# EAGLE design GSIOC (EAGLE 7.1.0)
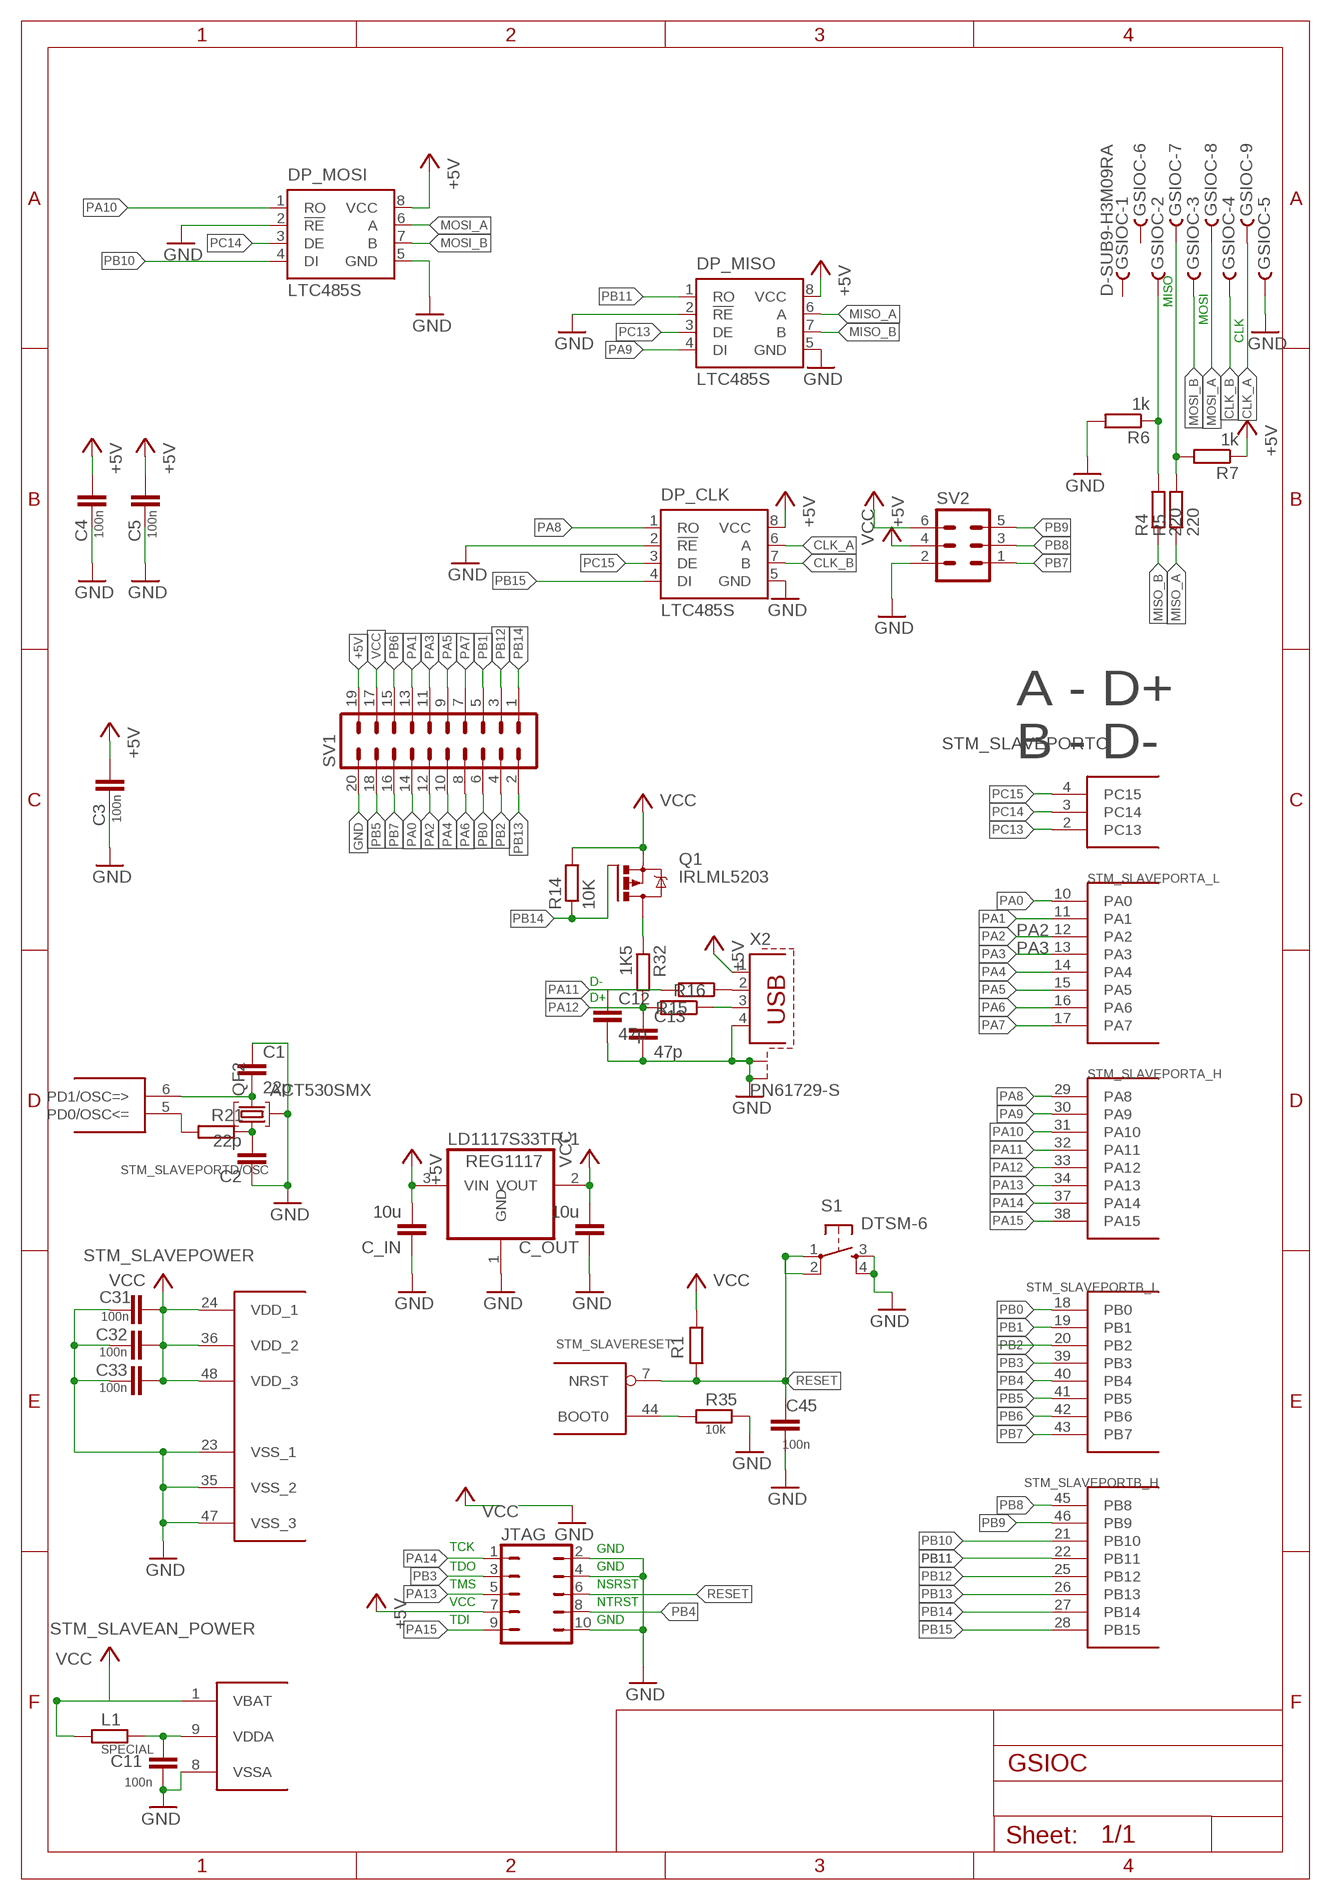
[diagram p0: schematic, sheet 1]

## Parts
C1  22p  C-EUC0805  [C0805]
C2  22p  C-EUC0805  [C0805]
C3  100n  C-EUC0805  [C0805]
C4  100n  C-EUC0805K  [C0805K]
C5  100n  C-EUC0805K  [C0805K]
C11  100n  C-EUC0805  [C0805]
C12  47p  C-EUC0805K  [C0805K]
C13  47p  C-EUC0805K  [C0805K]
C31  100n  C-EUC0805  [C0805]
C32  100n  C-EUC0805  [C0805]
C33  100n  C-EUC0805  [C0805]
C45  100n  C-EUC0805K  [C0805K]
C_IN  10u  C-EUC0805K  [C0805K]
C_OUT  10u  C-EUC0805K  [C0805K]
DP_CLK  LTC485S  [SOIC8]
DP_MISO  LTC485S  [SOIC8]
DP_MOSI  LTC485S  [SOIC8]
GSIOC  D-SUB9-H3M09RA  [H3M09RA]
JTAG  JP5Q  [JP5Q]
L1  SPECIAL  R-EU_M0805  [M0805]
LD1117S33TR-1  REG1117  [SOT223]
Q1  IRLML5203  [MICRO3]
QF2  ACT530SMX  [ACT_530SMX]
R1  5k  R-EU_M0805  [M0805]
R4  220  R-EU_M0805  [M0805]
R5  220  R-EU_M0805  [M0805]
R6  1k  R-EU_M0805  [M0805]
R7  1k  R-EU_M0805  [M0805]
R14  10K  R-EU_M0805  [M0805]
R15  22  R-EU_M0805  [M0805]
R16  22  R-EU_M0805  [M0805]
R21  R-EU_M0805  [M0805]
R32  1K5  R-EU_M0805  [M0805]
R35  10k  R-EU_M0805  [M0805]
S1  DTSM-6  [DTSM-6]
STM_SLAVE  STM32F10XCXT6  [TQFP48]
SV1  ML20L  [ML20L]
SV2  ML6L  [ML6L]
X2  PN61729-S  [PN61729-S]

## Nets
+5V: C3.1 C4.1 C5.1 C_IN.2 DP_CLK.8(VCC) DP_MISO.8(VCC) DP_MOSI.8(VCC) JTAG.7 LD1117S33TR-1.3(VIN) R7.1 SV1.19 SV2.6 X2.1
CLK_A: DP_CLK.6(A) GSIOC.9
CLK_B: DP_CLK.7(B) GSIOC.4
GND: C1.1 C2.1 C3.2 C4.2 C5.2 C11.2 C12.2 C13.2 C31.2 C32.2 C33.2 C45.2 C_IN.1 C_OUT.1 DP_CLK.2(!RE) DP_CLK.5(GND) DP_MISO.2(!RE) DP_MISO.5(GND) DP_MOSI.2(!RE) DP_MOSI.5(GND) GSIOC.5 JTAG.2 JTAG.4 JTAG.10 LD1117S33TR-1.1(GND) QF2.S$1(SHLD) QF2.S$2(SHLD) R6.2 R35.2 S1.3 S1.4 STM_SLAVE.8(AN_POWER:VSSA) STM_SLAVE.23(POWER:VSS_1) STM_SLAVE.35(POWER:VSS_2) STM_SLAVE.47(POWER:VSS_3) SV1.20 SV2.2 X2.4 X2.S1 X2.S2
MISO_A: DP_MISO.6(A) R5.1
MISO_B: DP_MISO.7(B) R4.1
MOSI_A: DP_MOSI.6(A) GSIOC.8
MOSI_B: DP_MOSI.7(B) GSIOC.3
N$1: C11.1 L1.2 STM_SLAVE.9(AN_POWER:VDDA)
N$3: GSIOC.2 R4.2 R6.1
N$5: GSIOC.7 R5.2 R7.2
N$14: R35.1 STM_SLAVE.44(RESET:BOOT0)
N$17: R16.1 X2.2
N$19: Q1.3(D) R32.1
N$21: R15.1 X2.3
N$35: C2.2 QF2.P1 R21.1
OSC<=: R21.2 STM_SLAVE.5(PORTD/OSC:PD0/OSC<=)
OSC=>: C1.2 QF2.P2 STM_SLAVE.6(PORTD/OSC:PD1/OSC=>)
PA0: STM_SLAVE.10(PORTA_L:PA0) SV1.14
PA1: STM_SLAVE.11(PORTA_L:PA1) SV1.13
PA2: STM_SLAVE.12(PORTA_L:PA2) SV1.12
PA3: STM_SLAVE.13(PORTA_L:PA3) SV1.11
PA4: STM_SLAVE.14(PORTA_L:PA4) SV1.10
PA5: STM_SLAVE.15(PORTA_L:PA5) SV1.9
PA6: STM_SLAVE.16(PORTA_L:PA6) SV1.8
PA7: STM_SLAVE.17(PORTA_L:PA7) SV1.7
PA8: DP_CLK.1(RO) STM_SLAVE.29(PORTA_H:PA8)
PA9: DP_MISO.4(DI) STM_SLAVE.30(PORTA_H:PA9)
PA10: DP_MOSI.1(RO) STM_SLAVE.31(PORTA_H:PA10)
PA11: C12.1 R16.2 STM_SLAVE.32(PORTA_H:PA11)
PA12: C13.1 R15.2 R32.2 STM_SLAVE.33(PORTA_H:PA12)
PA13: JTAG.5 STM_SLAVE.34(PORTA_H:PA13)
PA14: JTAG.1 STM_SLAVE.37(PORTA_H:PA14)
PA15: JTAG.9 STM_SLAVE.38(PORTA_H:PA15)
PB0: STM_SLAVE.18(PORTB_L:PB0) SV1.6
PB1: STM_SLAVE.19(PORTB_L:PB1) SV1.5
PB2: STM_SLAVE.20(PORTB_L:PB2) SV1.4
PB3: JTAG.3 STM_SLAVE.39(PORTB_L:PB3)
PB4: JTAG.8 STM_SLAVE.40(PORTB_L:PB4)
PB5: STM_SLAVE.41(PORTB_L:PB5) SV1.18
PB6: STM_SLAVE.42(PORTB_L:PB6) SV1.15
PB7: STM_SLAVE.43(PORTB_L:PB7) SV1.16 SV2.1
PB8: STM_SLAVE.45(PORTB_H:PB8) SV2.3
PB9: STM_SLAVE.46(PORTB_H:PB9) SV2.5
PB10: DP_MOSI.4(DI) STM_SLAVE.21(PORTB_H:PB10)
PB11: DP_MISO.1(RO) STM_SLAVE.22(PORTB_H:PB11)
PB12: STM_SLAVE.25(PORTB_H:PB12) SV1.3
PB13: STM_SLAVE.26(PORTB_H:PB13) SV1.2
PB14: Q1.1(G) R14.1 STM_SLAVE.27(PORTB_H:PB14) SV1.1
PB15: DP_CLK.4(DI) STM_SLAVE.28(PORTB_H:PB15)
PC13: DP_MISO.3(DE) STM_SLAVE.2(PORTC:PC13)
PC14: DP_MOSI.3(DE) STM_SLAVE.3(PORTC:PC14)
PC15: DP_CLK.3(DE) STM_SLAVE.4(PORTC:PC15)
RESET: C45.1 JTAG.6 R1.2 S1.1 S1.2 STM_SLAVE.7(RESET:NRST)
VCC: C31.1 C32.1 C33.1 C_OUT.2 L1.1 LD1117S33TR-1.2(VOUT) Q1.2(S) R1.1 R14.2 STM_SLAVE.1(AN_POWER:VBAT) STM_SLAVE.24(POWER:VDD_1) STM_SLAVE.36(POWER:VDD_2) STM_SLAVE.48(POWER:VDD_3) SV1.17 SV2.4
Unconnected: GSIOC.1 GSIOC.6

## Notes on the sheet
- MISO
- MOSI
- CLK
- A - D+
  B - D-
- D-
- D+
- TCK | GND
- TDO | GND
- TMS | NSRST
- VCC | NTRST
- TDI | GND

## Library data of the parts
C1-C3 C11 C31-C33 = resistor:C-EU: CAPACITOR, European symbol; SPICEPREFIX: C
C4 C5 C12 C13 C45 C_IN C_OUT = rcl:C-EU: CAPACITOR, European symbol
DP_CLK DP_MISO DP_MOSI = linear-technology:LTC485: Low Power RS485 Interface Transceiver Source: http://www.linear.com/pc/downloadDocument.do?navId=H0,C1,C1007,C1017,P2064,D1718; OC_FARNELL: unknown; OC_NEWARK: unknown
GSIOC = con-thomas-betts:D-SUB9-: D-Subminiatur Connector Source: Electronioc Interconnects European Edition 1998; OC_FARNELL: unknown; OC_NEWARK: unknown
JTAG = jumper:JP5Q: JUMPER
L1 R1 R4-R7 R14-R16 R21 R32 R35 = resistor:R-EU_: RESISTOR, European symbol; SPICEPREFIX: R
LD1117S33TR-1 = burr-brown:REG1117: 800mA and 1A Low Dropout (LDO) Positive Regulator 1.8V, 2.5V, 2.85V, 3.3V, 5V, and Adj; MPN: REG1117; OC_FARNELL: 1097566; OC_NEWARK: 14P6981
Q1 = transistor-power:IRLML5203: HEXFET P-Channel Power MOSFET
QF2 = smdQuartz:ACT530SMX
S1 = switch-tact:DTSM-6
STM_SLAVE = stm32:STM32F10XCXT6: ST STM32F101/103 48pin LQFP
SV1 = con-harting-ml:ML20: HARTING; OC_FARNELL: unknown; OC_NEWARK: unknown
SV2 = con-ml:ML6L: HARTING; OC_FARNELL: unknown; OC_NEWARK: unknown
X2 = con-berg:PN61729-S: BERG USB connector; OC_FARNELL: unknown; OC_NEWARK: unknown

## Board
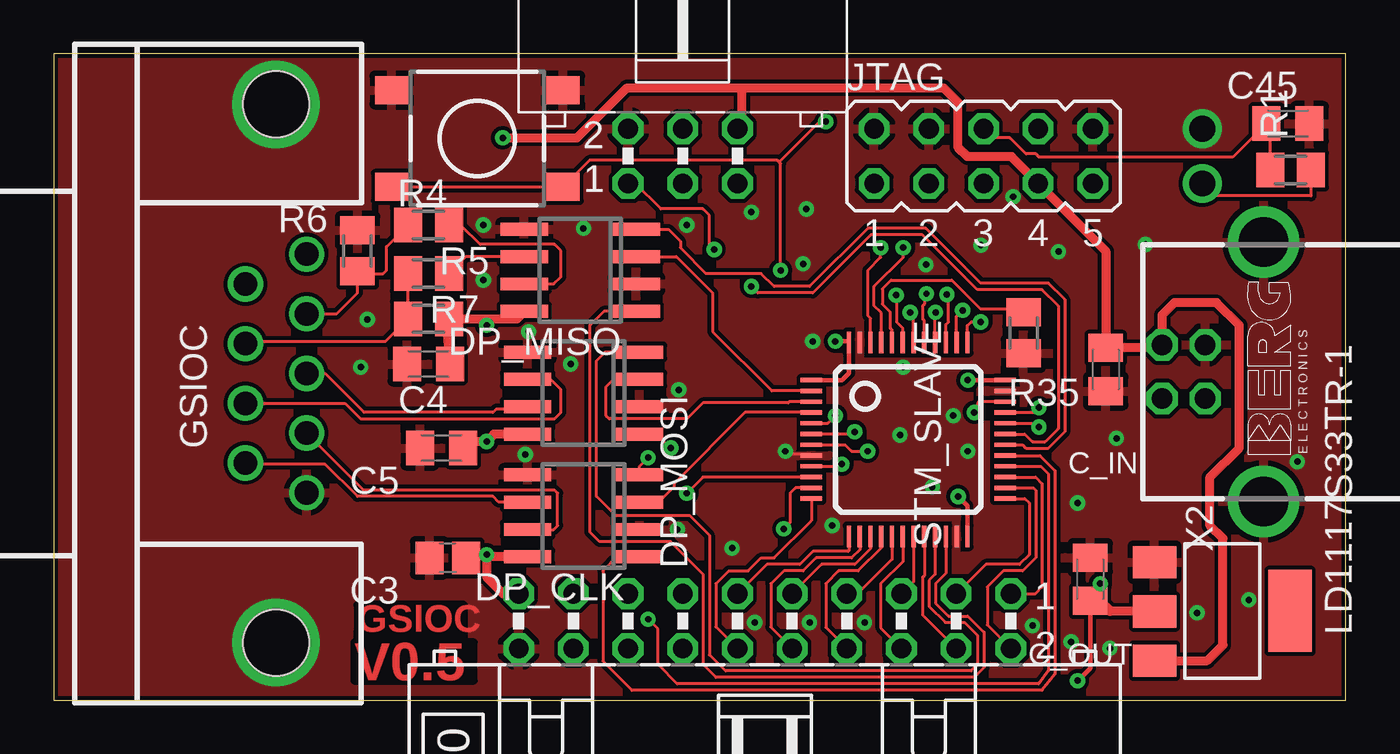
[diagram p1: board, top side]
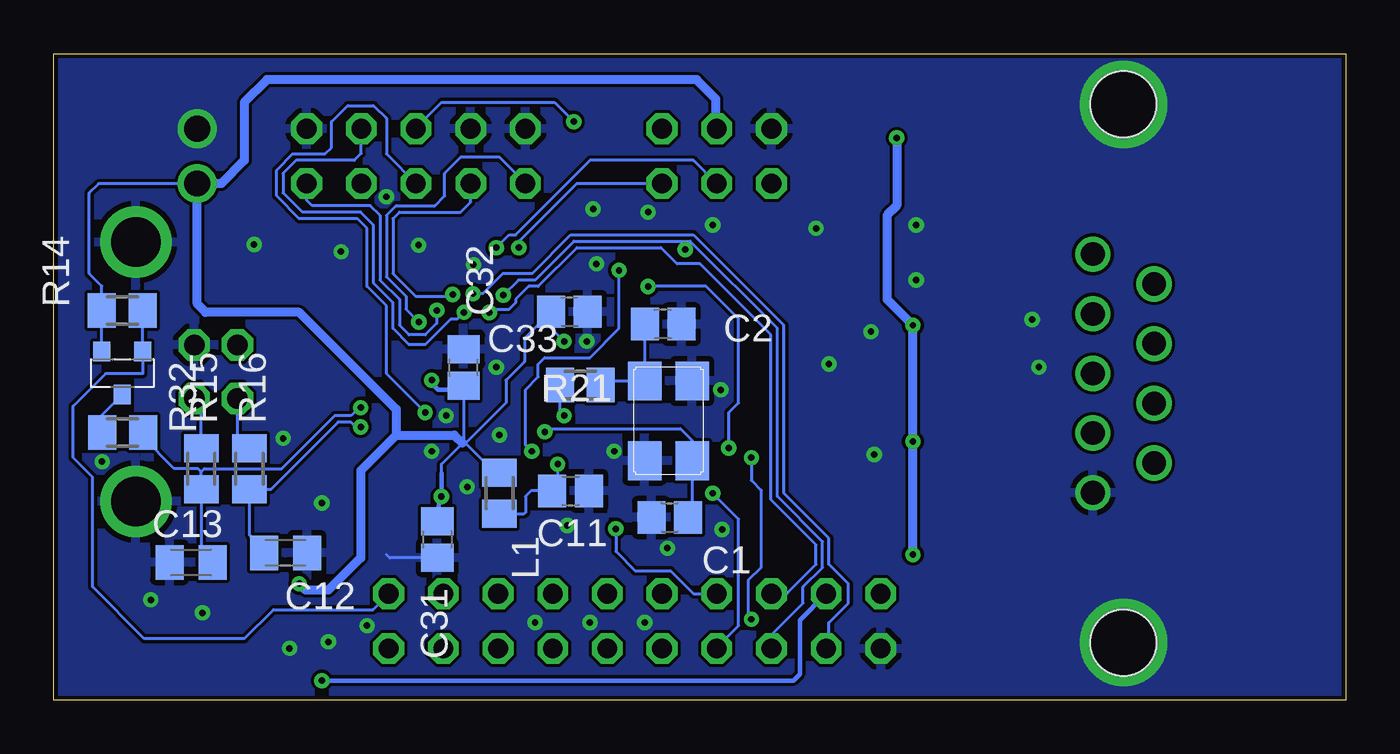
[diagram p2: board, bottom side, seen from below]

Size 60 x 30 mm. Coordinates in mm from the lower left corner, seen from the top.
Outline: 60,0 60,30 0,30 0,0 60,0
Copper layers (1*16): Top 0.018mm / dielectric 1.5mm / Bottom 0.018mm
Design rules "default": minimum track width 0.15mm, minimum drill 0.3mm, track to track 0.15mm, track to pad 0.15mm, pad to pad 0.15mm, via to via 0.15mm, smd to smd 0mil, copper to edge 0.2mm, drill to drill 0.2mm, minimum pad ring 10mil, minimum via ring 8mil, stop-mask expansion 4mil, vias tented up to drill 0.5mm, thermal gap 10mil

### Footprints (pad centres in the part's own frame; a part is rotated, then mirrored left to right if it is on the bottom)
C0805 = smd 1.3 x 1.5: 1 -0.85,0; 2 0.85,0
C0805K = smd 1.3 x 1.6: 1 -1,0; 2 1,0
SOIC8 = smd 0.6 x 2.2: 1 -1.905,-2.6; 2 -0.635,-2.6; 3 0.635,-2.6; 4 1.905,-2.6; 5 1.905,2.6; 6 0.635,2.6; 7 -0.635,2.6; 8 -1.905,2.6
H3M09RA = drill 1.092: 1 -5.537,1.422; 2 -2.769,1.422; 3 0,1.422; 4 2.769,1.422; 5 5.537,1.422; 6 -4.153,-1.422; 7 -1.384,-1.422; 8 1.384,-1.422; 9 4.153,-1.422 | hole 3.048: -12.497,0; 12.497,0
JP5Q = drill 0.914 octagon: 1 -5.08,-1.27; 2 -5.08,1.27; 3 -2.54,-1.27; 4 -2.54,1.27; 5 0,-1.27; 6 0,1.27; 7 2.54,-1.27; 8 2.54,1.27; 9 5.08,-1.27; 10 5.08,1.27
M0805 = smd 1.3 x 1.6: 1 -0.95,0; 2 0.95,0
SOT223 = smd 1.499 x 2.007: 1 -2.261,-3.15; 2 0.025,-3.15; 3 2.311,-3.15 | smd 3.81 x 2.007: 4 0,3.15
MICRO3 = smd 0.8 x 0.9: 1 -0.95,-1; 2 0.95,-1; 3 0,1
ACT_530SMX = smd 1.8 x 1.55: P1 -1.794,-1.187; P2 1.906,1.013; S$1 1.906,-1.187; S$2 -1.794,1.013
DTSM-6 = smd 1.55 x 1.3: 1 -3.975,2.25; 2 3.975,2.25; 3 -3.975,-2.25; 4 3.975,-2.25
TQFP48 = smd 0.2 x 1: 1 -2.75,-4.5; 2 -2.25,-4.5; 3 -1.75,-4.5; 4 -1.25,-4.5; 5 -0.75,-4.5; 6 -0.25,-4.5; 7 0.25,-4.5; 8 0.75,-4.5; 9 1.25,-4.5; 10 1.75,-4.5; 11 2.25,-4.5; 12 2.75,-4.5; 25 2.75,4.5; 26 2.25,4.5; 27 1.75,4.5; 28 1.25,4.5; 29 0.75,4.5; 30 0.25,4.5; 31 -0.25,4.5; 32 -0.75,4.5; 33 -1.25,4.5; 34 -1.75,4.5; 35 -2.25,4.5; 36 -2.75,4.5 | smd 1 x 0.2: 13 4.5,-2.75; 14 4.5,-2.25; 15 4.5,-1.75; 16 4.5,-1.25; 17 4.5,-0.75; 18 4.5,-0.25; 19 4.5,0.25; 20 4.5,0.75; 21 4.5,1.25; 22 4.5,1.75; 23 4.5,2.25; 24 4.5,2.75; 37 -4.5,2.75; 38 -4.5,2.25; 39 -4.5,1.75; 40 -4.5,1.25; 41 -4.5,0.75; 42 -4.5,0.25; 43 -4.5,-0.25; 44 -4.5,-0.75; 45 -4.5,-1.25; 46 -4.5,-1.75; 47 -4.5,-2.25; 48 -4.5,-2.75
ML20L = drill 0.914 octagon: 1 -11.43,-1.27; 2 -11.43,1.27; 3 -8.89,-1.27; 4 -8.89,1.27; 5 -6.35,-1.27; 6 -6.35,1.27; 7 -3.81,-1.27; 8 -3.81,1.27; 9 -1.27,-1.27; 10 -1.27,1.27; 11 1.27,-1.27; 12 1.27,1.27; 13 3.81,-1.27; 14 3.81,1.27; 15 6.35,-1.27; 16 6.35,1.27; 17 8.89,-1.27; 18 8.89,1.27; 19 11.43,-1.27; 20 11.43,1.27
ML6L = drill 0.914 octagon: 1 -2.54,-1.27; 2 -2.54,1.27; 3 0,-1.27; 4 0,1.27; 5 2.54,-1.27; 6 2.54,1.27
PN61729-S = drill 0.95 octagon: 1 1.25,4.71; 2 -1.25,4.71; 3 -1.25,2.71; 4 1.25,2.71 | drill 2.3 pad 2.9: S1 -6.02,0; S2 6.02,0

### Placement (x,y rotation side)
C1  31.4,8.47 0 bottom
C2  31.7,17.45 180 bottom
C3  18.3,6.6 180 top
C4  17.4,15.6 180 top
C5  18,11.7 180 top
C11  36,9.71 0 bottom
C12  49.24,6.83 0 bottom
C13  53.63,6.38 180 bottom
C31  42.19,7.46 270 bottom
C32  40.97,15.43 90 bottom
C33  36.06,18.03 0 bottom
C45  57.32,26.76 0 top
C_IN  48.86,15.34 90 top
C_OUT  48.13,5.6 270 top
DP_CLK  24.6,8.55 90 top
DP_MISO  24.45,19.95 90 top
DP_MOSI  24.6,14.25 90 top
GSIOC  10.32,15.16 270 top
JTAG  43.18,25.25 0 top
L1  39.3,9.6 270 bottom
LD1117S33TR-1  54.27,4.13 270 top
Q1  56.82,15.18 180 bottom
QF2  31.37,13.02 270 bottom
R1  57.44,24.6 180 top
R4  17.4,22.05 180 top
R5  17.4,19.8 180 top
R6  14.1,20.85 90 top
R7  17.4,17.7 180 top
R14  56.82,18.09 180 bottom
R15  53.16,10.73 270 bottom
R16  50.91,10.73 270 bottom
R21  35.55,14.62 180 bottom
R32  56.81,12.42 0 bottom
R35  45.03,17.05 270 top
S1  19.67,26.07 180 top
STM_SLAVE  39.68,12.1 270 top
SV1  33.02,3.66 180 top
SV2  29.21,25.25 0 top
X2  56.19,15.24 90 top

### Tracks (layer width: path | path; a pad name or v marks a point on that pad's centre or on a via)
+5V  (via drill 0.3)
  Top 0.406: DP_CLK.8 20.2,6.64 | 20.2,6.64 v20.1,6.75 20.1,5.7 20.87,4.93 SV1.19 | DP_MOSI.8 20.45,12.34 v20.1,12 19.15,12 C5.1 | 21.8,18 DP_MISO.8 21.5,17.7 20.1,17.7 | 20.2,6.64 19.16,6.75 C3.1 | C4.1 18.25,17.6 R7.1 20.1,17.7 | v20.1,17.4 20.1,17.7 | LD1117S33TR-1.3 53.57,1.82 54.3,2.55 54.3,7.5 53.7,8.1 53.7,10.35 55.05,11.7 55.05,17.4 54,18.45 52.05,18.45 51.48,17.88 X2.1 51.34,16.35 C_IN.2 48.86,20.84 JTAG.7 44.48,25.23 42.42,25.23 42,25.65 42,27.75 41.33,28.43 31.95,28.43 | v20.85,26.1 24.3,26.1 26.62,28.43 31.95,28.43 | SV2.6 31.95,26.72 31.95,28.43
  Bottom 0.406: v20.1,6.75 v20.1,12 v20.1,17.4 21.3,18.6 21.3,22.5 20.85,22.95 v20.85,26.1
CLK_A
  Top 0.15: GSIOC.9 8.96,10.95 12.6,10.95 14.1,9.45 20.4,9.45 20.66,9.19 DP_CLK.6
CLK_B
  Top 0.15: GSIOC.4 14.38,9.75 23.25,9.75 23.4,9.6 23.4,8.1 23.21,7.91 DP_CLK.7
GND  (via drill 0.3, 1.2, 3.05)
  Top 0.15: STM_SLAVE.8 35.13,11.4 34.05,11.4 | DP_MOSI.2 28.24,13.62
  Bottom 0.15: C31.2 42.01,6.61 42,6.6 44.4,6.6 44.55,6.75
  other vias: 36.15,8.1 40.8,9.9 42.45,11.55 39.45,15.45 41.77,13.2 19.95,19.5 14.25,15.45 22.05,17.1 21.9,11.4 19.95,22.05 53.34,26.52 33.98,11.55 31.5,7.05 47.55,9.15 49.05,2.4 53.1,4.05 55.5,4.65 49.35,12.15 50.7,21.15 28.96,7.91 29.02,14.4 35.25,16.65 39.3,12.3 34.8,20.25 34.95,22.8 32.4,22.65 29.4,22.05 24.6,21.9 24,15.6 35.1,3.6 37.65,3.6 45.45,3.45 32.55,3.6 47.25,2.7 44.56,23.36 40.51,20.21 43.06,21.11 46.66,20.81 14.56,17.66 57.76,11.06 10.32,27.66 10.32,2.66
  pour Bottom: 0,0 0,30 60,30 60,0
  pour Top (isolate 0.18): 0,0 0,30 60,30 60,0
MISO_A
  Top 0.15: DP_MISO.6 19.14,20.59 R5.1
MISO_B
  Top 0.15: DP_MISO.7 23.21,19.32 23.55,19.65 23.55,20.85 23.25,21.15 19.8,21.15 18.9,22.05 R4.1
MOSI_A
  Top 0.15: GSIOC.8 13.52,13.78 14.25,13.05 23.25,13.05 23.55,13.35 23.55,14.4 23.07,14.88 DP_MOSI.6
MOSI_B
  Top 0.15: GSIOC.3 12.59,15.16 14.4,13.35 20.4,13.35 20.55,13.5 21.89,13.5 DP_MOSI.7
N$1  (via drill 0.3)
  Top 0.15: STM_SLAVE.9 36.5,10.85 v36.6,10.95
  Bottom 0.15: v36.6,10.95 36.6,9.96 C11.1 37.84,9.71 38.1,9.45 38.1,8.7 38.15,8.65 L1.2
N$3
  Top 0.15: GSIOC.2 13.13,17.93 14.1,18.9 R6.1 14.2,19.8 14.55,19.8 | R4.2 15.45,21.05 15.45,19.95 15.3,19.8 14.55,19.8 | 14.55,19.8 14.55,19.35
N$5
  Top 0.15: R5.2 R7.2 15.4,16.65 9,16.65 GSIOC.7
N$14
  Top 0.15: STM_SLAVE.44 38.93,17.17 38.85,17.25 38.85,18 38.48,18.38 38.48,19.09 38.88,19.5 41.7,19.5 43.05,18.15 44.88,18.15 R35.1
N$17
  Bottom 0.15: X2.2 51.48,12.25 R16.1
N$19
  Bottom 0.15: Q1.3 57.76,13.24 R32.1
N$21
  Bottom 0.15: R15.1 53.16,13.66 X2.3
N$35
  Bottom 0.15: R21.1 34.4,14.82 QF2.P1 32.57,17.43 C2.2
OSC<=  (via drill 0.3)
  Top 0.15: STM_SLAVE.5 35.95,12.85 v36.3,13.2
  Bottom 0.15: v36.3,13.2 36.5,13.4 R21.2
OSC=>  (via drill 0.3)
  Top 0.15: v37.2,12.45 37.1,12.35 STM_SLAVE.6
  Bottom 0.15: v37.2,12.45 37.05,12.6 30.9,12.6 30.36,12.06 QF2.P2 30.36,8.67 C1.2
PA0  (via drill 0.3)
  Top 0.15: STM_SLAVE.10 30.15,10.35 v29.4,9.6
  Bottom 0.15: SV1.14 29.21,2.44 28.2,3.45 28.2,8.4 v29.4,9.6
PA1  (via drill 0.3)
  Top 0.15: STM_SLAVE.11 34.45,9.85 34.2,9.6 34.2,8.25 v33.9,7.95
  Bottom 0.15: v33.9,7.95 33.9,6.9 33,6 31.35,6 30.28,4.93 SV1.13
PA2
  Top 0.15: SV1.12 30.75,3.39 30.75,5.4 31.35,6 32.25,6 32.85,6.6 33.45,6.6 35.18,8.33 STM_SLAVE.12
PA3
  Top 0.15: STM_SLAVE.13 36.93,6.93 36.9,6.9 35.25,6.9 34.65,6.3 33.12,6.3 SV1.11
PA4
  Top 0.15: STM_SLAVE.14 37.43,6.98 37.05,6.6 35.4,6.6 34.8,6 33.9,6 33.3,5.4 33.3,3.38 SV1.10
PA5
  Top 0.15: STM_SLAVE.15 37.93,7.03 37.2,6.3 35.66,6.3 SV1.9
PA6
  Top 0.15: STM_SLAVE.16 38.43,7.08 37.35,6 36.45,6 35.85,5.4 35.85,3.37 SV1.8
PA7
  Top 0.15: STM_SLAVE.17 38.93,6.53 37.33,4.93 SV1.7
PA8
  Top 0.15: STM_SLAVE.29 45.8,11.35 46.5,10.65 46.5,1.2 45.9,0.45 26.85,0.45 25.5,1.8 25.5,6 26.14,6.64 DP_CLK.1
PA9
  Top 0.15: STM_SLAVE.30 45,11.85 45.15,11.7 46.2,11.7 46.95,12.45 46.95,18.6 46.2,19.35 43.05,19.35 40.5,21.9 37.8,21.9 35.1,19.2 33.45,19.2 32.85,19.8 30.3,19.8 29.1,21 29.1,21.3 28.55,21.86 DP_MISO.4
PA10  (via drill 0.3)
  Top 0.15: STM_SLAVE.31 45.1,12.35 45.45,12 46.05,12 46.65,12.6 46.65,18.3 45.9,19.05 42.9,19.05 40.35,21.6 37.95,21.6 35.25,18.9 32.7,18.9 v32.4,19.2 | DP_MOSI.1 28,12.34 v28.65,11.7
  Bottom 0.15: v28.65,11.7 28.65,13.35 28.2,13.8 28.2,17.7 29.7,19.2 v32.4,19.2
PA11  (via drill 0.3)
  Top 0.15: STM_SLAVE.32 45.58,12.85 v45.75,12.67
  Bottom 0.15: C12.1 50.91,7.66 R16.2 49.91,9.79 46.8,12.9 46.2,12.9 45.98,12.67 v45.75,12.67
PA12  (via drill 0.3)
  Top 0.15: STM_SLAVE.33 45.52,13.35 v45.75,13.57
  Bottom 0.15: 53.16,10.59 R15.2 53.16,6.76 C13.1 | 53.16,10.59 53.01,10.74 49.41,10.74 46.95,13.2 46.2,13.2 45.83,13.57 v45.75,13.57 | 53.16,10.59 53.3,10.74 54.4,10.74 55.86,12.2 R32.2
PA13  (via drill 0.3)
  Top 0.15: STM_SLAVE.34 42.95,13.85 v42.75,13.35
  Bottom 0.15: v42.75,13.35 44.55,15.15 44.55,18.3 45.45,19.2 45.45,21.9 45.9,22.35 48.6,22.35 49.65,23.4 49.65,24.6 48.9,25.35 47.4,25.35 47.1,25.65 47.1,26.85 46.35,27.6 45.15,27.6 44.55,27 44.55,25.35 JTAG.5
PA14  (via drill 0.3)
  Top 0.15: STM_SLAVE.37 42.43,17.38 42.6,17.55 v43.05,17.55
  Bottom 0.15: JTAG.1 38.23,24.13 39.3,25.2 41.1,25.2 41.85,24.45 41.85,23.4 42.3,22.95 44.1,22.95 44.55,22.5 44.55,19.65 43.65,18.75 43.65,18.15 v43.05,17.55
PA15  (via drill 0.3)
  Top 0.15: STM_SLAVE.38 41.93,17.81 v42.21,18.09
  Bottom 0.15: v42.21,18.09 42.21,17.49 42.75,16.95 43.5,16.95 43.95,17.4 43.95,18.6 44.85,19.5 44.85,22.5 45.3,22.95 48,22.95 48.26,23.21 JTAG.9
PB0
  Top 0.15: STM_SLAVE.18 39.43,6.43 38.4,5.4 38.4,3.36 SV1.6
PB1
  Top 0.15: STM_SLAVE.19 39.93,5.49 SV1.5
PB2
  Top 0.15: STM_SLAVE.20 40.43,5.78 40.35,5.7 40.35,3.95 SV1.4
PB3  (via drill 0.3)
  Top 0.15: STM_SLAVE.39 41.43,17.43 41.55,17.55 41.55,18.75 v41.48,18.83
  Bottom 0.15: v41.48,18.83 41.55,18.75 43.2,18.75 44.25,19.8 44.25,22.35 43.95,22.65 41.1,22.65 40.64,23.11 JTAG.3
PB4  (via drill 0.3)
  Top 0.15: STM_SLAVE.40 40.93,17.98 v40.95,18
  Bottom 0.15: v40.95,18 41.25,17.7 41.55,17.7 42.75,16.5 43.5,16.5 44.25,17.25 44.25,18.45 45.15,19.35 45.15,22.05 45.75,22.65 48.45,22.65 49.35,23.55 49.35,24.45 48.75,25.05 46.05,25.05 45.72,25.38 JTAG.8
PB5  (via drill 0.3)
  Top 0.15: v40.53,18.86 40.43,18.76 40.43,18.38 40.35,18.3 40.35,17.7 40.43,17.62 STM_SLAVE.41
  Bottom 0.15: SV1.18 24.01,2.39 24.01,3.59 23.1,4.5 23.1,5.4 24,6.3 24,7.5 26.1,9.6 26.1,17.4 30.3,21.6 36,21.6 37.8,19.8 39.15,19.8 40.09,18.86 v40.53,18.86 40.39,18.86
PB6  (via drill 0.3)
  Top 0.15: STM_SLAVE.42 39.93,17.9 v39.77,17.99
  Bottom 0.15: SV1.15 25.97,4.93 24.6,6.3 24.6,7.2 26.7,9.3 26.7,16.95 30,20.25 31.05,20.25 31.8,21 35.7,21 37.5,19.2 37.95,19.2 38.55,18.6 38.55,18.45 38.85,18.15 39.61,18.15 v39.77,17.99 39.63,18.15
PB7  (via drill 0.3)
  Top 0.15: STM_SLAVE.43 39.43,17.27 39.15,17.55 39.15,18.77 v39.13,18.8 | v30.67,20.92 30.45,21.14 30.45,22.5 30.15,22.8 28.2,22.8 27.02,23.98 SV2.1
  Bottom 0.15: SV1.16 26.67,3.03 25.2,4.5 25.2,5.25 24.3,6.15 24.3,7.35 26.4,9.45 26.4,17.25 30.45,21.3 | 30.45,21.3 35.85,21.3 37.65,19.5 38.42,19.5 v39.13,18.8 | 30.45,21.3 v30.67,20.92
PB8  (via drill 0.3)
  Top 0.15: STM_SLAVE.45 38.43,17.97 38.1,18.3 38.1,19.2 39.45,20.55 v39.45,21
  Bottom 0.15: SV2.3 29.23,23.98 30.3,25.05 35.1,25.05 38.55,21.6 38.85,21.6 v39.45,21
PB9  (via drill 0.3)
  Top 0.15: STM_SLAVE.46 37.93,17.72 37.8,17.85 37.8,19.95 38.4,20.55 v38.4,21
  Bottom 0.15: SV2.5 35.72,23.98 38.4,21.3 v38.4,21
PB10
  Top 0.15: STM_SLAVE.21 40.93,5.83 40.65,5.55 40.65,4.35 41.4,3.6 42.3,3.6 42.9,3 42.9,1.65 42.6,1.35 31.2,1.35 30.45,2.1 30.45,7.65 29.55,8.55 26.1,8.55 25.2,9.45 25.2,15.75 25.61,16.16 DP_MOSI.4
PB11
  Top 0.15: STM_SLAVE.22 41.43,5.88 40.95,5.4 40.95,4.5 41.55,3.9 42.45,3.9 43.2,3.15 43.2,1.5 42.75,1.05 30.75,1.05 30.15,1.65 30.15,5.85 28.65,7.35 25.35,7.35 24.9,7.8 24.9,17.4 25.55,18.05 DP_MISO.1
PB12
  Top 0.15: STM_SLAVE.25 45.1,9.35 45.3,9.15 45.3,6.75 44.85,6.3 43.28,6.3 SV1.3
PB13
  Top 0.15: STM_SLAVE.26 45.5,9.85 45.6,9.75 45.6,6.6 45,6 44.1,6 43.35,5.25 43.35,3.49 SV1.2
PB14
  Top 0.15: STM_SLAVE.27 45.6,10.35 45.9,10.05 45.9,5.25 45.58,4.93 SV1.1
  Bottom 0.15: R14.1 Q1.1 55.87,15.15 57.6,15.15 59.1,13.65 59.1,11.25 58.2,10.35 58.2,5.25 55.8,2.85 51.15,2.85 49.8,4.2 45.18,4.2 SV1.1
PB15  (via drill 0.3)
  Top 0.15: STM_SLAVE.28 45.85,10.85 46.2,10.5 46.2,1.35 45.75,0.75 28.95,0.75 28.05,1.65 28.05,3.3 v27.6,3.75 | DP_CLK.4 27.2,10.85 v27.6,11.25
  Bottom 0.15: v27.6,11.25 27.6,10.2 27.15,9.75 27.15,6.15 27.75,5.55 27.75,3.9 v27.6,3.75
PC13
  Top 0.15: DP_MISO.3 28.91,20.59 30.6,18.9 30.6,17.1 33.35,14.35 STM_SLAVE.2
PC14
  Top 0.15: STM_SLAVE.3 34.15,13.85 34.1,13.8 30.15,13.8 29.4,13.05 25.8,13.05 25.65,13.2 25.65,14.55 25.98,14.88 DP_MOSI.3
PC15
  Top 0.15: STM_SLAVE.4 32.1,13.35 28.8,10.05 28.8,9.9 28.09,9.19 DP_CLK.3
RESET  (via drill 0.3)
  Top 0.15: S1.2 S1.1 24.88,25.05 33.6,25.05 33.67,24.98 | STM_SLAVE.7 36.75,11.85 37.05,11.55 v37.8,11.55 | R1.2 56.49,26.59 C45.1 54.75,25.2 45.75,25.2 45.6,25.35 45.15,25.35 44.4,26.1 43.6,26.1 JTAG.6 | v33.75,19.95 33.75,24.9 33.67,24.98 | v35.85,26.85 35.55,26.85 33.67,24.98
  Bottom 0.15: v37.8,11.55 38.1,11.85 38.1,14.4 37.5,15 37.5,15.6 37.2,15.9 35.1,15.9 33.75,17.25 v33.75,19.95 | JTAG.6 43.18,26.57 42,27.75 36.75,27.75 v35.85,26.85
VCC  (via drill 0.3, 1.2)
  Top 0.15: R1.1 58.39,23.4 53.92,23.4 v53.34,23.98
  Top 0.2: STM_SLAVE.36 v42.45,14.85 | 36.93,16.47 36.93,15.18 36.6,14.85 STM_SLAVE.1 | STM_SLAVE.48 36.93,16.47 | 36.93,16.47 36.9,16.65 v36.3,16.65 | STM_SLAVE.24 42.43,9.02 v42,9.45 | v47.55,0.9 48.13,1.49 C_OUT.2
  Top 0.406: v48.6,5.4 48.6,4.57 | 48.6,4.57 C_OUT.2 | LD1117S33TR-1.2 49.06,4.11 48.6,4.57
  Bottom 0.15: C33.1 38.14,16.8 38.14,15.71 39,14.85 39,13.8 40.88,11.92 | Q1.2 R14.2 57.77,19.22 58.35,19.8 58.35,23.55 57.92,23.98 v53.34,23.98 | L1.1 39.5,10.55 40.88,11.92 | 40.88,11.92 40.95,12 | 42,10.52 42,10.95 41.02,11.92 40.95,12 | C32.1 40.97,12.02 40.95,12 | C33.1 | v36.3,16.65 36.91,17.26 C33.1
  Bottom 0.2: C31.1 42.13,8.96 42.09,9.36 v42,9.45 42,10.52 | v42.45,14.85 42.45,14.7 42.15,14.4 41.15,14.4 | C32.1 41.15,14.4 | 41.15,14.4 40.95,14.2 | SV1.17 25.35,3.71 25.35,1.2 25.65,0.9 v47.55,0.9
  Bottom 0.406: 44.1,12.3 41.4,12.3 41.02,11.92 | 44.1,12.3 44.1,13.5 48.6,18 52.95,18 53.34,18.39 v53.34,23.98 52.22,23.98 51.15,25.05 51.15,27.75 50.1,28.8 30.15,28.8 29.25,27.9 29.25,26.56 SV2.4 | 44.1,12.3 45.75,10.65 45.75,6.6 47.25,5.1 48.3,5.1 v48.6,5.4

### Text on the board
Top: GSIOC | V0.5
bValues: 12MHz